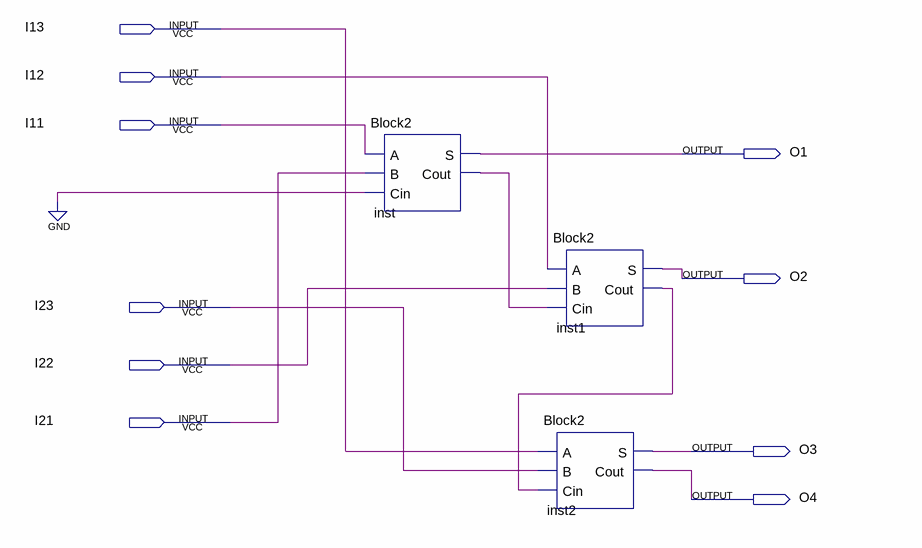
[diagram p0: schematic sheet]
// Quartus schematic three_bit_full_Adder.bdf as structural Verilog: 3 symbols, 10 pins
module three_bit_full_Adder (
  input  I13,
  input  I12,
  input  I11,
  input  I23,
  input  I22,
  input  I21,
  output O1,
  output O2,
  output O3,
  output O4
);

  wire inst1_cout, inst_cout;

  Block2 inst (.A(I11), .B(I21), .Cin(1'b0), .S(O1), .Cout(inst_cout));
  Block2 inst2 (.A(I13), .B(I23), .Cin(inst1_cout), .S(O3), .Cout(O4));
  Block2 inst1 (.A(I12), .B(I22), .Cin(inst_cout), .S(O2), .Cout(inst1_cout));
endmodule
